# EasyEDA Pro project ProPrj_Y车Y形板_2025-09-30.epro, board PCB11
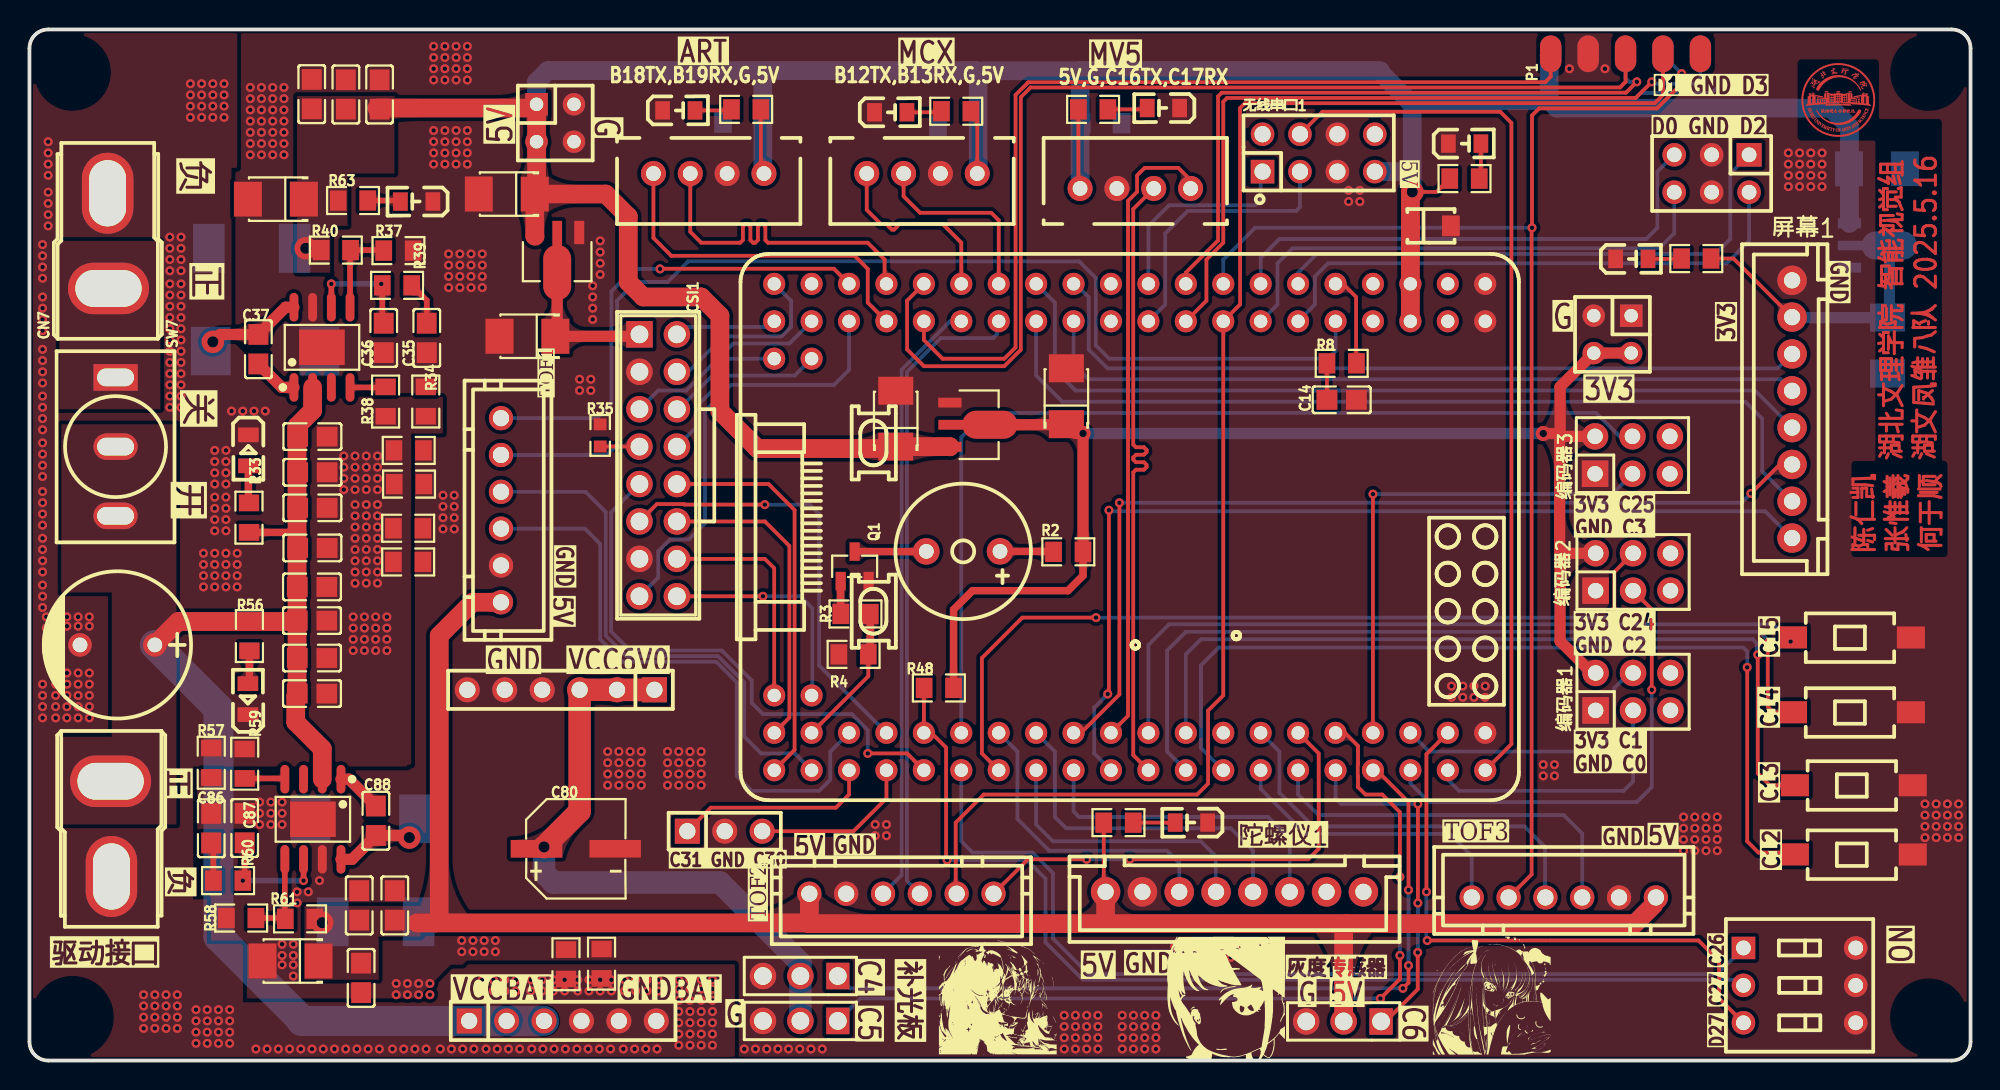
[diagram p6: board, top side]
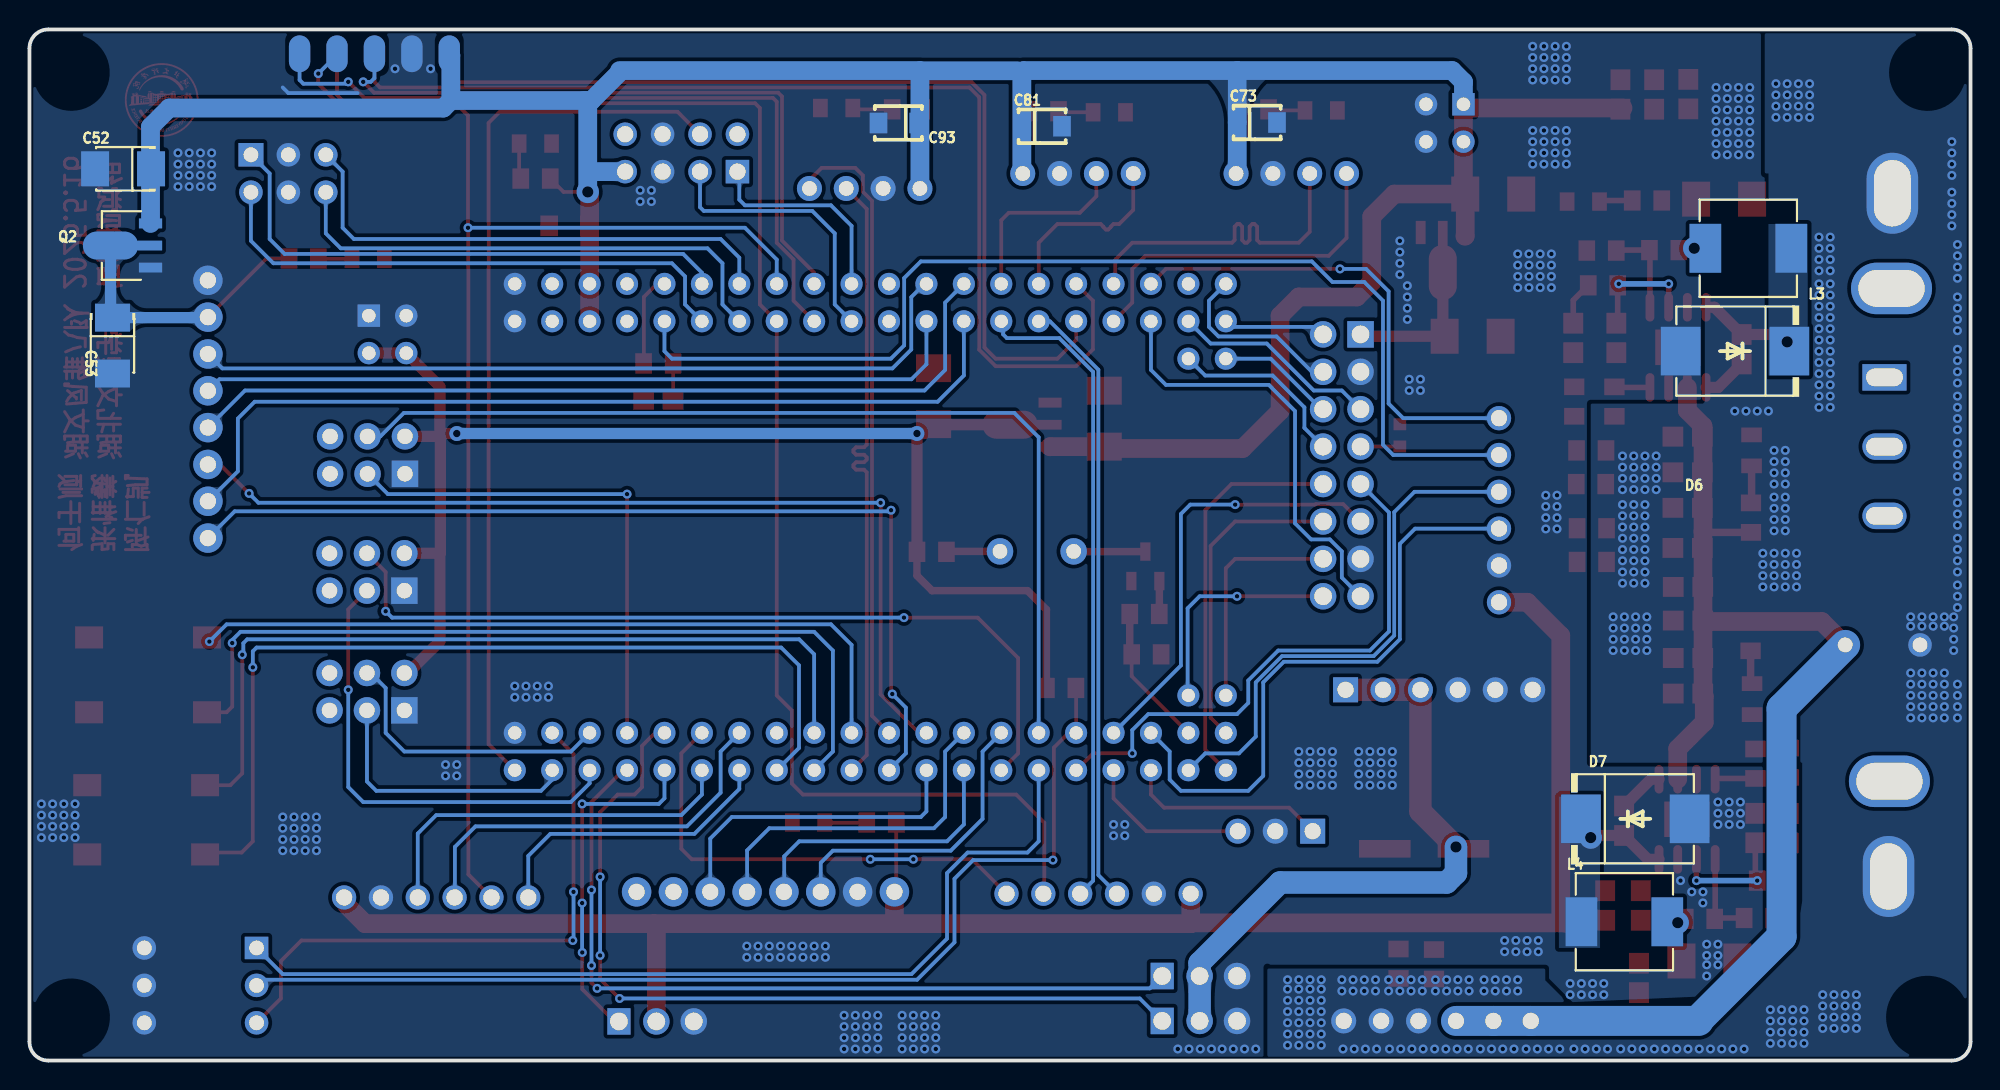
[diagram p7: board, bottom side, seen from below]

Outline 131.75 x 70 mm; copper layers: Top Layer, Bottom Layer. Coordinates in mm from the lower left corner of the outline.
Outline path: 0,68.73 0,1.27 arc(0.37,0.37) 1.27,0 130.48,0 arc(131.37,0.37) 131.75,1.27 131.75,68.73 arc(131.37,69.63) 130.48,70 1.27,70 arc(0.37,69.63) 0,68.73
Stack: Top Layer 0.035mm / Dielectric1 1.51mm FR4 er 4.5 / Bottom Layer 0.035mm

## Design rules (mm)
template: 自定义配置
spacing copperThickness1oz (default): track to track 0.102, other pairs 0.152 to 0.3
spacing copperThickness2oz: track to track 0.203, other pairs 0.152 to 0.3
track width copperThickness1oz (default): min 0.127, default 0.254, max 2.54
track width copperThickness2oz: min 0.203, default 0.254, max 2.54
differential pair differentialPair (default): width min 0.127, default 0.254, max 2.54; gap min 0.152, default 0.152
via viaSize (default): diameter min 0.5, default 0.61, max 10; hole min 0.3, default 0.305, max 6.3

## Placement (name value [footprint] x y rotation side)
BUZZER3  3kHz  [BUZ-TH_BD9.0-P5.00-D0.6-FD]  63.37 34.57 180 top
C1  TS-1101-C-W  [SW-SMD_L6.0-W3.3-LS8.0]  123.7 23.64 0 top
C12  TS-1101-C-W  [SW-SMD_L6.0-W3.3-LS8.0]  123.83 13.99 0 top
C13  TS-1101-C-W  [SW-SMD_L6.0-W3.3-LS8.0]  123.83 18.69 0 top
C14  10uF  [C0805]  89.06 44.86 180 top
C15  TS-1101-C-W  [SW-SMD_L6.0-W3.3-LS8.0]  123.7 28.72 0 top
C27  470uF  [CAP-TH_BD10.0-P5.00-D1.0-FD]  5.97 28.22 180 top
C31  4.7uF  [C0805]  19.2 34.8 180 top
C32  4.7uF  [C0805]  19.2 37.52 180 top
C33  4.7uF  [C0805]  19.2 39.94 180 top
C34  4.7uF  [C0805]  19.2 42.36 180 top
C35  620pF  [C0805]  26.97 49.06 90 top
C36  43pF  [C0805]  24.04 49.06 90 top
C37  1UF  [C0805]  15.54 48.29 90 top
C38  47uF  [CAP-SMD_L3.5-W2.8-R-RD]  16.73 58.48 0 top
C52  10uF  [CAP-SMD_L3.5-W2.8-R-RD]  125.39 60.54 180 bottom
C53  10uF  [CAP-SMD_L3.5-W2.8-R-RD]  126.11 48.54 90 bottom
C62  100nF  [C0805]  23.76 65.59 270 top
C63  100nF  [C0805]  21.48 65.59 270 top
C64  100nF  [C0805]  19.16 65.61 270 top
C65  10uF  [CAP-SMD_L3.5-W2.8-R-RD]  32.4 58.82 0 top
C66  10uF  [CAP-SMD_L3.5-W2.8-R-RD]  33.79 49.17 0 top
C67  10uF  [CAP-SMD_L3.5-W2.8-R-RD]  58.79 43.58 270 top
C68  10uF  [CAP-SMD_L3.5-W2.8-R-RD]  70.38 45.1 270 top
C70  22uF  [CAP-SMD_L3.2-W1.6]  95.12 56.67 0 top
C73  22uF  [CAP-SMD_L3.2-W1.6]  48.42 63.68 180 bottom
C80  220uF  [CAP-SMD_BD6.3-L6.6-W6.6-LS7.4-FD]  37.08 14.37 0 top
C81  22uF  [CAP-SMD_L3.2-W1.6]  63.01 63.43 180 bottom
C82  4.7uF  [C0805]  19.18 24.92 180 top
C83  4.7uF  [C0805]  19.18 27.33 180 top
C84  4.7uF  [C0805]  19.18 29.87 180 top
C85  4.7uF  [C0805]  19.18 32.15 180 top
C86  620pF  [C0805]  12.34 15.77 270 top
C87  43pF  [C0805]  14.61 15.78 270 top
C88  1UF  [C0805]  23.51 16.28 270 top
C89  47uF  [CAP-SMD_L3.5-W2.8-R-RD]  17.72 6.76 0 top
C90  100nF  [C0805]  22.38 10.53 270 top
C91  100nF  [C0805]  22.51 5.61 90 top
C92  100nF  [C0805]  24.79 10.53 270 top
C93  22uF  [CAP-SMD_L3.2-W1.6]  72.77 63.65 0 bottom
CN5  AM-1015B-M  [CONN-TH_AM-1015B-M]  5.53 15.73 270 top
CN7  AM-1015B-M  [CONN-TH_AM-1015B-M]  5.33 55.65 90 top
CSI1  2.54-2*8P针  [HDR-TH_16P-P2.54-V-M-R2-C8-S2.54]  42.67 40.41 270 top
D6  SS86  [SMC_L6.9-W5.9-LS7.9-RD]  15.99 48.17 0 bottom
D7  SS86  [SMC_L6.9-W5.9-LS7.9-RD]  22.75 16.41 180 bottom
H8  -  [HDR-TH_4P-P2.54-V-M-R2-C2-S2.54-1]  107.44 49.3 180 top
H9  -  [HDR-TH_4P-P2.54-V-M-R2-C2-S2.54-1]  35.69 63.65 270 top
H57  PZ254V-11-06P  [HDR-TH_6P-P2.54-V-M]  36.07 25.17 180 top
H60  77311-102-03LF  [HDR-TH_3P-P2.54-V-M-1]  52.32 5.74 180 top
H61  77311-102-03LF  [HDR-TH_3P-P2.54-V-M-1]  52.32 2.69 180 top
H62  -  [HDR-TH_6P-P2.54-V-F-R2-C3-S2.54]  114.17 60.22 180 top
H63  PZ254V-11-06P  [HDR-TH_6P-P2.54-V-M]  36.2 2.69 0 top
H68  77311-102-03LF  [HDR-TH_3P-P2.54-V-M-1]  89.2 2.66 180 top
H69  PZ254V-11-03P  [HDR-TH_3P-P2.54-V-M]  47.19 15.57 0 top
L3  15uH  [IND-SMD_L7.1-W6.6]  15.09 55.14 0 bottom
L4  15uH  [IND-SMD_L7.1-W6.6]  23.5 9.42 180 bottom
LED8  NCD0805R1  [LED0805-R-RD]  14.86 41.42 270 top
LED9  NCD0805R1  [LED0805-R-RD]  14.83 24.54 90 top
LED10  NCD0805R1  [LED0805-RD]  108.76 54.42 0 top
LED11  NCD0805R1  [LED0805-RD]  78.87 16.15 180 top
LED12  NCD0805R1  [LED0805-RD]  97.41 62.25 0 top
LED13  NCD0805R1  [LED0805-RD]  26.28 58.32 180 top
LED14  NCD0805R1  [LED0805-RD]  76.96 64.67 180 top
LED15  NCD0805R1  [LED0805-RD]  58.45 64.38 0 top
LED16  NCD0805R1  [LED0805-RD]  44.07 64.5 0 top
P1  -  [HDR2X5-OB]  108.33 68.35 90 top
Q1  S8050  [SOT-23-3_L2.9-W1.3-P1.90-LS2.4-BR]  56.01 33.55 270 top
Q2  AMS1117-3.3V  [SOT-89-3_L4.5-W2.5-P1.50-LS4.2-BR]  124.88 55.33 180 bottom
Q6  AMS1117-3.3V  [SOT-89-3_L4.5-W2.5-P1.50-LS4.2-BR]  35.82 54.86 90 top
Q7  AMS1117-3.3V  [SOT-89-3_L4.5-W2.5-P1.50-LS4.2-BR]  63.83 43.17 180 top
R2  10R  [R0805]  70.51 34.54 180 top
R3  4.7K  [R0805]  56.06 30.32 180 top
R4  10K  [R0805]  55.94 27.58 180 top
R8  10K  [R0805]  89.06 47.33 180 top
R33  1kΩ  [R0805]  14.9 36.86 270 top
R34  0Ω  [R0805]  26.9 44.74 90 top
R35  10kΩ  [R0603]  38.73 42.44 270 top
R37  10kΩ  [R0805]  25.04 54.99 180 top
R38  75kΩ  [R0805]  24.17 44.74 90 top
R39  18.7kΩ  [R0805]  24.95 52.63 180 top
R40  52.3kΩ  [R0805]  20.79 55.02 0 top
R48  4.7K  [R0805]  61.72 25.3 180 top
R50  0Ω  [R0805]  25.7 33.85 0 top
R51  0Ω  [R0805]  25.76 39.14 0 top
R52  0Ω  [R0805]  25.7 36.14 0 top
R53  0Ω  [R0805]  38.83 6.57 90 top
R54  0Ω  [R0805]  25.74 41.42 0 top
R55  0Ω  [R0805]  36.41 6.54 90 top
R56  1kΩ  [R0805]  14.93 28.82 90 top
R57  0Ω  [R0805]  12.34 20.22 270 top
R58  10kΩ  [R0805]  14.37 9.68 0 top
R59  75kΩ  [R0805]  14.61 20.15 270 top
R60  18.7kΩ  [R0805]  13.48 12.22 0 top
R61  52.3kΩ  [R0805]  18.37 9.62 180 top
R62  4.7K  [R0805]  97.4 59.88 180 top
R63  4.7K  [R0805]  21.96 58.39 180 top
R64  4.7K  [R0805]  72.19 64.58 180 top
R65  4.7K  [R0805]  62.9 64.45 0 top
R66  4.7K  [R0805]  73.91 16.15 180 top
R67  2.2K  [R0805]  113.13 54.45 0 top
R68  4.7K  [R0805]  48.64 64.58 0 top
SW6  KF1001-03P-R0-GL-DFT-01B  [SW-TH_6P-L9.9-W9.0-P2.54-LS7.6]  120.14 5.1 270 top
SW7  MT-0-103-A101-M200-RS+PJ  [SW-TH_MT-0-103-A101-M200-RS]  5.84 41.68 270 top
TOF1  WAFER-XH2.54-6PZZ  [CONN-TH_XH2.54-6P]  32 37.36 90 top
TOF2  WAFER-XH2.54-6PZZ  [CONN-TH_XH2.54-6P]  59.18 11.33 0 top
TOF3  WAFER-XH2.54-6PZZ  [CONN-TH_XH2.54-6P]  104.14 11.07 180 top
U1  TPS54540DDAR  [SOIC-8_L4.9-W3.9-P1.27-LS6.0-BL-EP]  19.85 48.42 0 top
U6  -  [AUFE_RT1064]  74.68 36.22 180 top
U27  TPS54540DDAR  [SOIC-8_L4.9-W3.9-P1.27-LS6.0-BL-EP]  19.24 16.38 180 top
U29  B4B-XH-A(LF)(SN)  [CONN-TH_B4B-XH-A-LF-SN]  60.58 60.22 180 top
U30  B4B-XH-A(LF)(SN)  [CONN-TH_B4B-XH-A-LF-SN]  75.06 59.2 0 top
U31  B4B-XH-A(LF)(SN)  [CONN-TH_B4B-XH-A-LF-SN]  46.1 60.22 180 top
屏幕1  WAFER-XH2.54-8PZZ  [CONN-TH_8P-P2.50-XH2.54-8P]  119.63 44.22 270 top
无线串口1  -  [HDR-TH_8P-P2.54-V-F-R2-C4-S2.54-1]  87.5 61.62 0 top
编码器1  67997-206HLF  [HDR-TH_6P-P2.54-V-M-R2-C3-S2.54-1]  108.84 25.04 0 top
编码器2  67997-206HLF  [HDR-TH_6P-P2.54-V-M-R2-C3-S2.54-1]  108.84 33.17 0 top
编码器3  67997-206HLF  [HDR-TH_6P-P2.54-V-M-R2-C3-S2.54-1]  108.8 41.11 0 top
陀螺仪1  WAFER-XH2.54-8PZZ  [CONN-TH_8P-P2.50-XH2.54-8P]  81.79 11.45 0 top

## Footprints (pads in the part's own frame, mm; a bottom-side part is the same pattern mirrored in y, then rotated)
AUFE_RT1064
  round 1.5 hole 0.9x0.9: 1(-24.13,-16.51) 2(-24.13,-13.97) 3(-21.59,-16.51) 4(-21.59,-13.97) 5(-19.05,-16.51) 6(-19.05,-13.97) 7(-16.51,-16.51) 8(-16.51,-13.97) 9(-13.97,-16.51) 10(-13.97,-13.97) 11(-11.43,-16.51) 12(-11.43,-13.97) 13(-8.89,-16.51) 14(-8.89,-13.97) 15(-6.35,-16.51) 16(-6.35,-13.97) 17(-3.81,-16.51) 18(-3.81,-13.97) 19(-1.27,-16.51) 20(-1.27,-13.97) 21(1.27,-16.51) 22(1.27,-13.97) 23(3.81,-16.51) 24(3.81,-13.97) 25(6.35,-16.51) 26(6.35,-13.97) 27(8.89,-16.51) 28(8.89,-13.97) 29(11.43,-16.51) 30(11.43,-13.97) 31(13.97,-16.51) 32(13.97,-13.97) 33(16.51,-16.51) 34(16.51,-13.97) 35(19.05,-16.51) 36(19.05,-13.97) 37(21.59,-16.51) 38(21.59,-13.97) 39(24.13,-16.51) 40(24.13,-13.97) 41(21.59,-11.43) 42(24.13,-11.43) 43(24.13,11.43) 44(21.59,11.43) 45(24.13,13.97) 46(24.13,16.51) 47(21.59,13.97) 48(21.59,16.51) 49(19.05,13.97) 50(19.05,16.51) 51(16.51,13.97) 52(16.51,16.51) 53(13.97,13.97) 54(13.97,16.51) 55(11.43,13.97) 56(11.43,16.51) 57(8.89,13.97) 58(8.89,16.51) 59(6.35,13.97) 60(6.35,16.51) 61(3.81,13.97) 62(3.81,16.51) 63(1.27,13.97) 64(1.27,16.51) 65(-1.27,13.97) 66(-1.27,16.51) 67(-3.81,13.97) 68(-3.81,16.51) 69(-6.35,13.97) 70(-6.35,16.51) 71(-8.89,13.97) 72(-8.89,16.51) 73(-11.43,13.97) 74(-11.43,16.51) 75(-13.97,13.97) 76(-13.97,16.51) 77(-16.51,13.97) 78(-16.51,16.51) 79(-19.05,13.97) 80(-19.05,16.51) 81(-21.59,13.97) 82(-21.59,16.51) 83(-24.13,13.97) 84(-24.13,16.51)
BUZ-TH_BD9.0-P5.00-D0.6-FD
  round 1.8 hole 1: 1(-2.5,0) 2(2.5,0)
C0805
  rect 1.41x1.35 smd: 1(-1,0) 2(1,0)
CAP-SMD_BD6.3-L6.6-W6.6-LS7.4-FD
  rect 3.5x1.2 smd: 1(-2.67,0) 2(2.67,0)
CAP-SMD_L3.2-W1.6
  rect 1.2x1.4 smd: 1(-1.35,0) 2(1.35,0)
CAP-SMD_L3.5-W2.8-R-RD
  rect 1.9x2.376 smd: 1(1.899,0) 2(-1.899,0)
CAP-TH_BD10.0-P5.00-D1.0-FD
  round 1.6 hole 1: 1(-2.54,0) 2(2.54,0)
CONN-TH_8P-P2.50-XH2.54-8P
  round 2 hole 1.1: 1(8.75,0) 2(6.25,0) 3(3.75,0) 4(1.25,0) 5(-1.25,0) 6(-3.75,0) 7(-6.25,0) 8(-8.75,0)
CONN-TH_AM-1015B-M
  oval 3.5x5.5 hole 2.5x4.5: 1(-3.231,-0.029)
  oval 5.5x3.5 hole 4.5x2.5: 2(3.231,0.029)
CONN-TH_B4B-XH-A-LF-SN
  round 1.7 hole 1: 1(3.75,0) 2(1.25,0) 3(-1.25,0) 4(-3.75,0)
CONN-TH_XH2.54-6P
  round 1.65 hole 1.1: 1(-6.25,0) 2(-3.75,0) 3(-1.25,0) 4(1.25,0) 5(3.75,0) 6(6.25,0)
HDR2X5-OB
  rrect 2.5x1.45 smd: 1(0,5.08) 3(0,2.54) 5(0,0) 7(0,-2.54) 9(0,-5.08)
  rrect 2.5x1.45 smd far side: 2(0,5.08) 4(0,2.54) 6(0,0) 8(0,-2.54) 10(0,-5.08)
HDR-TH_3P-P2.54-V-M
  rect 1.7x1.7 hole 1.1: 1(-2.54,0)
  round 1.7 hole 1.1: 2(0,0) 3(2.54,0)
HDR-TH_3P-P2.54-V-M-1
  rect 1.575x1.8 hole 1.2: 1(-2.54,0)
  round 1.8 hole 1.2: 2(0,0) 3(2.54,0)
HDR-TH_4P-P2.54-V-M-R2-C2-S2.54-1
  rect 1.524x1.524 hole 0.914: 1(-1.27,-1.27)
  round 1.524 hole 0.914: 2(-1.27,1.27) 3(1.27,-1.27) 4(1.27,1.27)
HDR-TH_6P-P2.54-V-F-R2-C3-S2.54
  rect 1.7x1.6 hole 1: 1(-2.54,-1.27)
  round 1.6 hole 1: 2(-2.54,1.27) 3(0,-1.27) 4(0,1.27) 5(2.54,-1.27) 6(2.54,1.27)
HDR-TH_6P-P2.54-V-M
  rect 1.7x1.7 hole 1.1: 1(-6.35,0)
  round 1.7 hole 1.1: 2(-3.81,0) 3(-1.27,0) 4(1.27,0) 5(3.81,0) 6(6.35,0)
HDR-TH_6P-P2.54-V-M-R2-C3-S2.54-1
  rect 1.8x1.8 hole 1.05: 1(-2.54,-1.27)
  round 1.8 hole 1.05: 2(-2.54,1.27) 3(0,-1.27) 4(0,1.27) 5(2.54,-1.27) 6(2.54,1.27)
HDR-TH_8P-P2.54-V-F-R2-C4-S2.54-1
  rect 1.6x1.6 hole 1.1: 1(-3.81,-1.27)
  round 1.6 hole 1.1: 2(-3.81,1.27) 3(-1.27,-1.27) 4(-1.27,1.27) 5(1.27,-1.27) 6(1.27,1.27) 7(3.81,-1.27) 8(3.81,1.27)
HDR-TH_16P-P2.54-V-M-R2-C8-S2.54
  rect 1.8x1.8 hole 1.2: 1(-8.89,-1.27)
  round 1.8 hole 1.2: 2(-8.89,1.27) 3(-6.35,-1.27) 4(-6.35,1.27) 5(-3.81,-1.27) 6(-3.81,1.27) 7(-1.27,-1.27) 8(-1.27,1.27) 9(1.27,-1.27) 10(1.27,1.27) 11(3.81,-1.27) 12(3.81,1.27) 13(6.35,-1.27) 14(6.35,1.27) 15(8.89,-1.27) 16(8.89,1.27)
IND-SMD_L7.1-W6.6
  rect 2.15x3.32 smd: 1(-2.913,0) 2(2.913,0)
LED0805-R-RD
  rect 1x1.399 smd: 1(1.05,0) 2(-1.05,0)
LED0805-RD
  rect 1x1.25 smd: 1(-1.1,0) 2(1.1,0)
R0603
  rect 0.806x0.864 smd: 1(-0.753,0) 2(0.753,0)
R0805
  rect 1.133x1.377 smd: 1(-1,0) 2(1,0)
SMC_L6.9-W5.9-LS7.9-RD
  rect 2.7x3.3 smd: 1(-3.687,0) 2(3.687,0)
SOIC-8_L4.9-W3.9-P1.27-LS6.0-BL-EP
  oval 0.602x1.941 smd: 1(-1.905,-2.72) 2(-0.635,-2.72) 3(0.635,-2.72) 4(1.905,-2.72) 5(1.905,2.72) 6(0.635,2.72) 7(-0.635,2.72) 8(-1.905,2.72)
  rect 3.098x2.41 smd: 9(0,0)
SOT-23-3_L2.9-W1.3-P1.90-LS2.4-BR
  rect 1.25x0.7 smd: 1(1,-0.95) 2(1,0.95) 3(-1,0)
SOT-89-3_L4.5-W2.5-P1.50-LS4.2-BR
  rect 1.575x0.672 smd: 1(1.356,-1.5) 3(1.356,1.5)
  custom 5.377x1.9 smd: 2(-1.356,0)
SW-SMD_L6.0-W3.3-LS8.0
  rect 1.9x1.5 smd: 1(-4,0) 2(4,0)
SW-TH_6P-L9.9-W9.0-P2.54-LS7.6
  rect 1.524x1.6 hole 1: 1(-2.54,-3.809)
  round 1.6 hole 1: 2(0,-3.81) 3(2.54,-3.81) 4(2.54,3.81) 5(0,3.81) 6(-2.54,3.81)
SW-TH_MT-0-103-A101-M200-RS
  rect 1.8x3 hole 1.2x2.5: 1(-4.7,0)
  oval 1.8x3 hole 1.2x2.5: 2(0,0) 3(4.7,0)

## Nets
3V3: C68.1 H8.2 H8.4 Q7.2 R2.1 R48.1 编码器1.2 编码器2.2 编码器3.2
3V31: C53.1 Q2.2 R67.2 屏幕1.7
GND: C1.2 C12.2 C13.2 C14.1 C15.2 C35.1 C36.1 C38.2 C52.2 C53.2 C62.1 C63.1 C64.1 C65.2 C66.2 C67.2 C68.2 C70.2 C73.2 C80.2 C81.2 C86.1 C87.1 C89.2 C90.1 C91.1 C92.1 C93.2 CSI1.3 CSI1.13 D6.2 D7.2 H8.1 H8.3 H9.2 H9.4 H57.4 H57.5 H57.6 H60.3 H61.3 H62.3 H62.4 H68.3 H69.2 LED10.1 LED11.1 LED12.1 LED13.1 LED14.1 LED15.1 LED16.1 P1.3 P1.4 Q1.2 Q2.1 Q6.1 Q7.1 R4.2 R34.2 R35.1 R37.1 R50.2 R51.2 R52.2 R53.2 R54.2 R55.2 R57.2 R58.1 SW6.4 SW6.5 SW6.6 TOF1.2 TOF2.2 TOF3.2 U1.7 U1.9 U6.1 U6.2 U6.83 U27.7 U27.9 U29.3 U30.3 U31.3 屏幕1.8 无线串口1.5 无线串口1.6 编码器1.1 编码器2.1 编码器3.1 陀螺仪1.7
GNDBAT: C27.2 C31.1 C32.1 C33.1 C34.1 C82.1 C83.1 C84.1 C85.1 CN5.2 CN7.2 H63.4 H63.5 H63.6 LED8.2 LED9.2 R34.1 R38.1 R50.1 R51.1 R52.1 R53.1 R54.1 R55.1 R57.1 R59.1
VCC5V: C38.1 C52.1 C62.2 C63.2 C64.2 C65.1 C67.1 C70.1 C73.1 C81.1 C93.1 H9.1 H9.3 L3.2 P1.2 Q2.3 Q6.3 Q7.3 R40.1 R62.2 R63.2 R64.2 R65.2 R68.2 U6.5 U6.6 U29.4 U30.4 U31.4 无线串口1.7
VCC5V0: C89.1 C90.2 C91.2 C92.2 H68.2 L4.2 R61.1 R66.2 TOF1.1 TOF2.1 TOF3.1 陀螺仪1.8
VCC6V0: C80.1 H57.1 H57.2 H57.3 H60.2 H61.2
VCCBAT: C27.1 C31.2 C32.2 C33.2 C34.2 C82.2 C83.2 C84.2 C85.2 CN5.1 H63.1 H63.2 H63.3 R33.2 R56.2 SW7.2 SW7.3 U1.2 U27.2
B0: U6.23 屏幕1.6
B1: U6.24 屏幕1.5
B2: U6.25 屏幕1.4
B3: U6.26 屏幕1.2
B9: TOF1.3 U6.49
B10: TOF1.4 U6.48
B11: R3.1 R4.1 U6.47
B12_TX: U6.29 U29.1
B13_RX: U6.27 U29.2
B14: TOF2.3 U6.30
B15: TOF2.4 U6.28
B16: P1.1 U6.32
B17: P1.5 U6.31
B18_TX: U6.34 U31.1
B19_RX: U6.33 U31.2
B20: CSI1.15 U6.36
B21: TOF1.6 U6.35
B22: CSI1.5 U6.38
B24: CSI1.2 U6.40
B25: CSI1.4 U6.39
B26: CSI1.6 U6.42
B27: CSI1.8 U6.41
B28: CSI1.10 U6.46
B29: CSI1.12 U6.45
B30: CSI1.14 U6.43
B31: CSI1.16 U6.44
C0: U6.82 编码器1.3
C1: U6.79 编码器1.4
C2: U6.80 编码器2.3
C3: U6.77 编码器3.3
C4: H60.1 U6.78
C5: H61.1 U6.75
C6: H68.1 U6.76
C7: TOF2.6 U6.73
C8: TOF3.3 U6.74
C9: TOF3.4 U6.71
C10: TOF3.6 U6.72
C12: C12.1 U6.70
C13: C13.1 U6.67
C14: C1.1 U6.68
C15: C15.1 U6.65
C16_TX: U6.66 U30.2
C17_RX: U6.63 U30.1
C18: U6.64 屏幕1.1
C19: U6.61 屏幕1.3
C20: U6.62 陀螺仪1.3
C21: U6.59 陀螺仪1.4
C22: U6.60 陀螺仪1.5
C23: U6.57 陀螺仪1.6
C24: U6.58 编码器2.4
C25: U6.55 编码器3.4
C26: SW6.1 U6.56
C27: R48.2 SW6.2 U6.53
C28: CSI1.9 U6.54
C29: CSI1.11 U6.51
C30: H69.3 U6.52
C31: H69.1 U6.50
CR: C14.2 R8.2
CSI-3V3: C66.1 CSI1.1 Q6.2
D0: H62.6 U6.14
D1: H62.5 U6.13
D2: H62.2 U6.12
D3: H62.1 U6.11
D4: TOF1.5 U6.10
D12: P1.8 TOF3.5 U6.15
D13: P1.7 TOF2.5 U6.16
D14: P1.6 U6.17
D15: P1.10 U6.18
D16: U6.19 无线串口1.1
D17: U6.20 无线串口1.3
D26: U6.84 无线串口1.4
D27: SW6.3 U6.81
$1N5765: Q1.1 R3.2
$1N5766: BUZZER3.2 Q1.3
$1N5940: BUZZER3.1 R2.2
$1N5970: CSI1.7 R35.2
$1N5984: R38.2 U1.4
$1N5985: C37.1 U1.1
$1N5986: C37.2 D6.1 L3.1 U1.8
$1N5987: C36.2 R39.2 U1.6
$1N5988: C35.2 R39.1
$1N5989: R37.2 R40.2 U1.5
$1N6012: R8.1 U6.9
$1N6034: LED8.1 R33.1
$1N6099: R59.2 U27.4
$1N6100: C88.1 U27.1
$1N6101: C88.2 D7.1 L4.1 U27.8
$1N6102: C87.2 R60.2 U27.6
$1N6103: C86.2 R60.1
$1N6104: R58.2 R61.2 U27.5
$1N6110: LED9.1 R56.1
$1N6112: LED12.2 R62.1
$1N6115: LED13.2 R63.1
$1N6120: LED14.2 R64.1
$1N6124: LED15.2 R65.1
$1N6125: LED11.2 R66.1
$1N6127: LED10.2 R67.1
$1N9649: LED16.2 R68.1
$1N16320: CN7.1 SW7.1

Pads without a net: P1 9; U1 3; U6 3 4 7 8 21 22 37 69; U27 3; 无线串口1 2 8; 编码器1 5 6; 编码器2 5 6; 编码器3 5 6; 陀螺仪1 1 2

## Via types
v1: diameter 0.61, hole 0.305, Top Layer to Bottom Layer, 671 vias
v2: diameter 1.524, hole 0.762, Top Layer to Bottom Layer, 6 vias
v3: diameter 1.016, hole 0.508, Top Layer to Bottom Layer, 2 vias

## Routing (per net, layer and track width the routed paths; a pad name or vN(x,y) marks a point on that pad's centre or on a via; arc(x,y) is an arc through that point)
3V3: length 94.7
  Top Layer w0.508: R2.1 71.51,32.92 70.48,31.9 64.01,31.9 62.72,30.61 R48.1
  Top Layer w0.762: 103.86,42.34 103.86,34.47 103.89,34.44 ; 103.86,42.34 103.63,42.57 v3(102.74,42.57) ; 103.86,42.34 103.86,42.38 103.89,42.38 ; 65.19,43.17 70.34,43.17 C68.1 71.01,42.57 v3(71.51,42.57) R2.1 ; 103.89,34.44 编码器2.2 ; 103.89,34.44 103.89,28.47 106.05,26.31 ; 103.89,42.38 103.89,45.75 106.17,48.03 108.71,48.03 ; 103.89,42.38 编码器3.2
  Bottom Layer w0.762: v3(71.51,42.57) 102.74,42.57 v3(102.74,42.57)
3V31: length 18.6
  Top Layer w0.254: R67.2 115.66,54.45 屏幕1.7
  Bottom Layer w0.762: 屏幕1.7 119.67,50.44 C53.1 126.24,50.56 Q2.2
GND: length 5.2
  Bottom Layer w0.254: 114.55,66.06 114.17,65.68 109.47,65.68
  vias: v1(14.99,66.06) v1(14.99,65.3) v1(14.99,64.54) v1(14.99,63.78) v1(14.99,63.02) v1(14.99,62.25) v1(14.99,61.49) v1(15.62,17.55) v1(15.62,16.79) v1(15.62,16.03) v1(15.75,66.06) v1(15.75,65.3) v1(15.75,64.54) v1(15.75,63.78) v1(15.75,63.02) v1(15.75,62.25) v1(15.75,61.49) v1(16.38,17.55) v1(16.38,16.79) v1(16.38,16.03) v1(16.51,66.06) v1(16.51,65.3) v1(16.51,64.54) v1(16.51,63.78) v1(16.51,63.02) v1(16.51,62.25) v1(16.51,61.49) v1(17.15,17.55) v1(17.15,16.79) v1(17.15,16.03) v1(17.15,7.9) v1(17.15,7.13) v1(17.15,6.5) v1(17.27,66.06) v1(17.27,65.3) v1(17.27,64.54) v1(17.27,63.78) v1(17.27,63.02) v1(17.27,62.25) v1(17.27,61.49) v1(17.91,7.9) v1(17.91,7.13) v1(17.91,6.5) v1(17.91,5.74) v1(18.16,11.45) v1(18.17,10.7) v1(18.92,11.45) v1(19.69,12.22) v1(24.89,5.23) v1(24.89,4.47) v1(25.65,5.23) v1(25.65,4.47) v1(26.42,5.23) v1(26.42,4.47) v1(27.18,5.23) v1(27.18,4.47) v1(27.43,68.86) v1(27.43,68.09) v1(27.43,67.33) v1(27.43,66.57) v1(27.43,63.14) v1(27.43,62.38) v1(27.43,61.62) v1(27.43,60.86) v1(28.07,38.38) v1(28.07,37.61) v1(28.07,36.85) v1(28.07,36.09) v1(28.19,68.86) v1(28.19,68.09) v1(28.19,67.33) v1(28.19,66.57) v1(28.19,63.14) v1(28.19,62.38) v1(28.19,61.62) v1(28.19,60.86) v1(28.45,54.76) v1(28.45,54) v1(28.45,53.24) v1(28.45,52.47) v1(28.83,38.38) v1(28.83,37.61) v1(28.83,36.85) v1(28.83,36.09) v1(28.96,68.86) v1(28.96,68.09) v1(28.96,67.33) v1(28.96,66.57) v1(28.96,63.14) v1(28.96,62.38) v1(28.96,61.62) v1(28.96,60.86) v1(29.21,54.76) v1(29.21,54) v1(29.21,53.24) v1(29.21,52.47) v1(29.34,8.15) v1(29.34,7.39) v1(29.72,68.86) v1(29.72,68.09) v1(29.72,67.33) v1(29.72,66.57) v1(29.72,63.14) v1(29.72,62.38) v1(29.72,61.62) v1(29.72,60.86) v1(29.97,54.76) v1(29.97,54) v1(29.97,53.24) v1(29.97,52.47) v1(30.1,8.15) v1(30.1,7.39) v1(30.73,54.76) v1(30.73,54) v1(30.73,53.24) v1(30.73,52.47) v1(30.86,8.15) v1(30.86,7.39) v1(31.62,8.15) v1(31.62,7.39) v1(37.34,46.25) v1(37.34,45.49) v1(38.1,46.25) v1(38.1,45.49) v1(38.23,52.6) v1(38.23,51.84) v1(38.23,51.08) v1(38.23,50.31) v1(38.73,55.65) v1(38.73,54.89) v1(38.73,54.12) v1(38.73,53.36) v1(39.24,20.98) v1(39.24,20.22) v1(39.24,19.45) v1(39.24,18.69) v1(40.01,20.98) v1(40.01,20.22) v1(40.01,19.45) v1(40.01,18.69) v1(40.77,20.98) v1(40.77,20.22) v1(40.77,19.45) v1(40.77,18.69) v1(41.53,20.98) v1(41.53,20.22) v1(41.53,19.45) v1(41.53,18.69) v1(43.31,20.98) v1(43.31,20.22) v1(43.31,19.45) v1(43.31,18.69) v1(44.07,20.98) v1(44.07,20.22) v1(44.07,19.45) v1(44.07,18.69) v1(44.83,20.98) v1(44.83,20.22) v1(44.83,19.45) v1(44.83,18.69) v1(45.59,20.98) v1(45.59,20.22) v1(45.59,19.45) v1(45.59,18.69) v1(48.51,0.78) v1(49.28,0.78) v1(50.04,0.78) v1(50.8,0.78) v1(51.52,0.78) v1(52.28,0.78) v1(53.04,0.78) v1(53.8,0.78) v1(57.4,16.03) v1(57.4,15.26) v1(58.17,16.03) v1(58.17,15.26) v1(70.23,3.07) v1(70.23,2.31) v1(70.23,1.55) v1(70.23,0.78) v1(70.99,3.07) v1(70.99,2.31) v1(70.99,1.55) v1(70.99,0.78) v1(71.76,3.07) v1(71.76,2.31) v1(71.76,1.55) v1(71.76,0.78) v1(72.52,3.07) v1(72.52,2.31) v1(72.52,1.55) v1(72.52,0.78) v1(74.17,3.07) v1(74.17,2.31) v1(74.17,1.55) v1(74.17,0.78) v1(74.93,3.07) v1(74.93,2.31) v1(74.93,1.55) v1(74.93,0.78) v1(75.69,3.07) v1(75.69,2.31) v1(75.69,1.55) v1(75.69,0.78) v1(76.45,3.07) v1(76.45,2.31) v1(76.45,1.55) v1(76.45,0.78) v1(77.72,7.77) v1(77.72,7.01) v1(78.49,7.77) v1(78.49,7.01) v1(79.25,7.77) v1(79.25,7.01) v1(80.01,7.77) v1(80.01,7.01) v1(80.77,7.77) v1(80.77,7.01) v1(81.53,7.77) v1(81.53,7.01) v1(82.3,7.77) v1(82.3,7.01) v1(83.06,7.77) v1(83.06,7.01) v1(89.54,59.08) v1(89.54,58.32) v1(90.3,59.08) v1(90.3,58.32) v1(96.52,25.42) v1(96.52,24.66) v1(97.28,25.42) v1(97.28,24.66) v1(98.04,25.42) v1(98.04,24.66) v1(98.81,25.42) v1(98.81,24.66) v1(102.74,20.09) v1(102.74,19.33) v1(103.51,20.09) v1(103.51,19.33) v1(104.52,67.33) v1(106.93,67.33) v1(112.27,16.53) v1(112.27,15.77) v1(112.27,15.01) v1(112.27,14.25) v1(113.03,16.53) v1(113.03,15.77) v1(113.03,15.01) v1(113.03,14.25) v1(113.79,16.53) v1(113.79,15.77) v1(113.79,15.01) v1(113.79,14.25) v1(114.55,16.53) v1(114.55,15.77) v1(114.55,15.01) v1(114.55,14.25) v1(119.38,61.62) v1(119.38,60.86) v1(119.38,60.09) v1(119.38,59.33) v1(120.14,61.62) v1(120.14,60.86) v1(120.14,60.09) v1(120.14,59.33) v1(120.9,61.62) v1(120.9,60.86) v1(120.9,60.09) v1(120.9,59.33) v1(121.67,61.62) v1(121.67,60.86) v1(121.67,60.09) v1(121.67,59.33) v1(128.65,17.42) v1(128.65,16.66) v1(128.65,15.9) v1(128.65,15.14) v1(129.41,17.42) v1(129.41,16.66) v1(129.41,15.9) v1(129.41,15.14) v1(130.18,17.42) v1(130.18,16.66) v1(130.18,15.9) v1(130.18,15.14) v1(130.94,17.42) v1(130.94,16.66) v1(130.94,15.9) v1(130.94,15.14)
GNDBAT:
  vias: v1(0.89,55.39) v1(0.89,54.63) v1(0.89,53.87) v1(0.89,53.11) v1(0.89,51.84) v1(0.89,51.08) v1(0.89,50.31) v1(0.89,49.55) v1(0.89,48.28) v1(0.89,47.52) v1(0.89,46.76) v1(0.89,46) v1(0.89,45.11) v1(0.89,44.35) v1(0.89,43.58) v1(0.89,42.82) v1(0.89,41.93) v1(0.89,41.17) v1(0.89,40.41) v1(0.89,39.65) v1(0.89,38.63) v1(0.89,37.87) v1(0.89,37.11) v1(0.89,36.34) v1(0.89,35.46) v1(0.89,34.69) v1(0.89,33.93) v1(0.89,33.17) v1(0.89,32.28) v1(0.89,31.52) v1(0.89,30.76) v1(0.89,25.55) v1(0.89,24.79) v1(0.89,24.03) v1(0.89,23.26) v1(1.14,30.12) v1(1.14,29.36) v1(1.14,28.6) v1(1.14,27.84) v1(1.27,62.38) v1(1.27,61.62) v1(1.27,60.86) v1(1.27,60.09) v1(1.27,58.95) v1(1.27,58.19) v1(1.27,57.43) v1(1.27,56.67) v1(1.78,30.12) v1(1.78,29.49) v1(1.78,26.31) v1(1.78,25.55) v1(1.78,24.79) v1(1.78,24.03) v1(1.78,23.26) v1(2.54,30.12) v1(2.54,29.49) v1(2.54,26.31) v1(2.54,25.55) v1(2.54,24.79) v1(2.54,24.03) v1(2.54,23.26) v1(3.3,30.12) v1(3.3,29.49) v1(3.3,26.31) v1(3.3,25.55) v1(3.3,24.79) v1(3.3,24.03) v1(3.3,23.26) v1(4.06,30.12) v1(4.06,29.49) v1(4.06,26.31) v1(4.06,25.55) v1(4.06,24.79) v1(4.06,24.03) v1(4.06,23.26) v1(7.75,4.47) v1(7.75,3.71) v1(7.75,2.94) v1(7.75,2.18) v1(8.51,4.47) v1(8.51,3.71) v1(8.51,2.94) v1(8.51,2.18) v1(9.27,4.47) v1(9.27,3.71) v1(9.27,2.94) v1(9.27,2.18) v1(9.53,55.9) v1(9.53,55.14) v1(9.53,54.38) v1(9.53,53.62) v1(9.53,52.73) v1(9.53,51.97) v1(9.53,51.2) v1(9.53,50.44) v1(9.53,49.68) v1(9.53,48.92) v1(9.53,48.16) v1(9.53,47.39) v1(9.53,46.63) v1(9.53,45.87) v1(9.53,45.11) v1(9.53,44.35) v1(10.03,4.47) v1(10.03,3.71) v1(10.03,2.94) v1(10.03,2.18) v1(10.29,55.9) v1(10.29,55.14) v1(10.29,54.38) v1(10.29,53.62) v1(10.29,52.73) v1(10.29,51.97) v1(10.29,51.2) v1(10.29,50.44) v1(10.29,49.68) v1(10.29,48.92) v1(10.29,48.16) v1(10.29,47.39) v1(10.29,46.63) v1(10.29,45.87) v1(10.29,45.11) v1(10.29,44.35) v1(10.92,66.32) v1(10.92,65.56) v1(10.92,64.79) v1(10.92,64.03) v1(11.3,3.45) v1(11.3,2.69) v1(11.3,1.93) v1(11.3,1.17) v1(11.68,66.32) v1(11.68,65.56) v1(11.68,64.79) v1(11.68,64.03) v1(11.81,34.44) v1(11.81,33.68) v1(11.81,32.92) v1(11.81,32.15) v1(12.06,3.45) v1(12.06,2.69) v1(12.06,1.93) v1(12.06,1.17) v1(12.45,66.32) v1(12.45,65.56) v1(12.45,64.79) v1(12.45,64.03) v1(12.57,41.42) v1(12.57,40.66) v1(12.57,39.9) v1(12.57,39.14) v1(12.57,38.25) v1(12.57,37.49) v1(12.57,36.73) v1(12.57,35.96) v1(12.57,34.44) v1(12.57,33.68) v1(12.57,32.92) v1(12.57,32.15) v1(12.83,3.45) v1(12.83,2.69) v1(12.83,1.93) v1(12.83,1.17) v1(13.21,66.32) v1(13.21,65.56) v1(13.21,64.79) v1(13.21,64.03) v1(13.34,41.42) v1(13.34,40.66) v1(13.34,39.9) v1(13.34,39.14) v1(13.34,38.25) v1(13.34,37.49) v1(13.34,36.73) v1(13.34,35.96) v1(13.34,34.44) v1(13.34,33.68) v1(13.34,32.92) v1(13.34,32.15) v1(13.59,3.45) v1(13.59,2.69) v1(13.59,1.93) v1(13.59,1.17) v1(13.72,44.09) v1(14.1,34.44) v1(14.1,33.68) v1(14.1,32.92) v1(14.1,32.15) v1(14.48,44.09) v1(15.24,44.09) v1(15.37,0.78) v1(16,44.09) v1(16.13,0.78) v1(16.89,0.78) v1(17.65,0.78) v1(18.42,0.78) v1(19.18,0.78) v1(19.94,0.78) v1(20.7,0.78) v1(21.34,41.04) v1(21.34,40.28) v1(21.34,39.52) v1(21.34,38.76) v1(21.46,0.78) v1(21.97,30.12) v1(21.97,29.36) v1(21.97,28.6) v1(21.97,27.84) v1(22.1,41.04) v1(22.1,40.28) v1(22.1,39.52) v1(22.1,38.76) v1(22.1,37.74) v1(22.1,36.98) v1(22.1,36.22) v1(22.1,35.46) v1(22.1,34.69) v1(22.1,33.93) v1(22.1,33.17) v1(22.1,32.4) v1(22.23,0.78) v1(22.73,30.12) v1(22.73,29.36) v1(22.73,28.6) v1(22.73,27.84) v1(22.86,41.04) v1(22.86,40.28) v1(22.86,39.52) v1(22.86,38.76) v1(22.86,37.74) v1(22.86,36.98) v1(22.86,36.22) v1(22.86,35.46) v1(22.86,34.69) v1(22.86,33.93) v1(22.86,33.17) v1(22.86,32.41) v1(22.99,0.78) v1(23.5,30.12) v1(23.5,29.36) v1(23.5,28.6) v1(23.5,27.84) v1(23.62,41.04) v1(23.62,40.28) v1(23.62,39.52) v1(23.62,38.76) v1(23.62,37.74) v1(23.62,36.98) v1(23.62,36.22) v1(23.62,35.46) v1(23.62,34.69) v1(23.62,33.93) v1(23.62,33.17) v1(23.62,32.41) v1(23.75,0.78) v1(24.26,30.12) v1(24.26,29.36) v1(24.26,28.6) v1(24.26,27.84) v1(24.64,0.78) v1(25.4,0.78) v1(26.16,0.78) v1(26.92,0.78) v1(27.88,0.78) v1(28.64,0.78) v1(29.4,0.78) v1(30.17,0.78) v1(30.73,5.48) v1(30.73,4.72) v1(30.99,0.78) v1(31.5,5.48) v1(31.5,4.72) v1(31.75,0.78) v1(32.26,5.48) v1(32.26,4.72) v1(32.51,0.78) v1(33.02,5.48) v1(33.02,4.72) v1(33.27,0.78) v1(34.04,5.48) v1(34.04,4.72) v1(34.09,0.78) v1(34.8,5.48) v1(34.8,4.72) v1(34.85,0.78) v1(35.56,5.48) v1(35.56,4.72) v1(35.61,0.78) v1(36.32,5.48) v1(36.32,4.72) v1(36.37,0.78) v1(37.21,5.48) v1(37.21,4.72) v1(37.15,0.78) v1(37.92,0.78) v1(37.97,5.48) v1(37.97,4.72) v1(38.68,0.78) v1(38.73,5.48) v1(38.73,4.72) v1(39.5,5.48) v1(39.5,4.72) v1(39.44,0.78) v1(40.31,0.78) v1(40.39,5.48) v1(40.39,4.72) v1(41.07,0.78) v1(41.15,5.48) v1(41.15,4.72) v1(41.91,5.48) v1(41.91,4.72) v1(41.83,0.78) v1(42.59,0.78) v1(42.67,5.48) v1(42.67,4.72) v1(44.07,5.48) v1(44.07,4.85) v1(44.07,4.09) v1(44.07,3.32) v1(44.07,2.56) v1(44.07,1.8) v1(44.07,1.04) v1(44.83,5.48) v1(44.83,4.85) v1(44.83,4.09) v1(44.83,3.32) v1(44.83,2.56) v1(44.83,1.8) v1(44.83,1.04) v1(45.59,5.48) v1(45.59,4.85) v1(45.59,4.09) v1(45.59,3.32) v1(45.59,2.56) v1(45.59,1.8) v1(45.59,1.04) v1(46.36,5.48) v1(46.36,4.85) v1(46.36,4.09) v1(46.36,3.32) v1(46.36,2.56) v1(46.36,1.8) v1(46.36,1.04)
VCC5V: length 219.4
  Top Layer w0.254: U29.4 64.33,64.02 R65.2 ; R62.2 95.49,58.97 v2(93.85,58.97) ; R64.2 71.19,59.32 U30.4 ; R68.2 49.64,60.43 U31.4
  Top Layer w1.27: C65.1 34.3,55.98 34.32,55.96 ; C65.1 39.12,58.82 40.64,57.3 40.64,52.86 41.66,51.84 45.59,51.84 46.86,50.57 46.86,44.09 49.4,41.55 58.67,41.55 C67.1 62.46,41.68 Q7.3 ; C65.1 34.42,58.94 34.42,64.67 23.59,64.67 ; v2(93.85,58.97) 93.73,58.84 U6.5 U6.6
  Bottom Layer w1.27: 103.14,65.17 94.08,65.17 93.85,64.94 v2(93.85,58.97) ; 103.14,65.17 103.65,64.67 122.26,64.67 123.53,63.4 Q2.3 ; 103.14,65.17 103.14,68.24 P1.2 ; U31.4 49.77,60.3 C73.1 49.77,67.21 ; 91.69,67.21 71.31,67.21 U30.4 ; 71.3,67.19 64.69,67.19 ; 49.77,67.21 64.26,67.21 64.39,67.08 64.39,60.28 U29.4 ; 49.77,67.21 35.18,67.21 34.42,66.44 34.42,65.3 ; 无线串口1.7 93.6,60.35 ; 93.98,65.17 93.6,65.17 91.69,67.08
  vias: v2(18.75,55.14)
VCC5V0: length 124.3
  Top Layer w0.254: 72.91,15.77 72.91,11.58 陀螺仪1.8
  Top Layer w1.27: 89.37,9.29 89.2,9.12 H68.2 ; 89.37,9.29 108.97,9.29 110.24,10.56 ; 89.37,9.29 52.93,9.29 ; 52.93,9.29 52.93,9.3 TOF2.1 ; 52.93,9.29 52.88,9.34 27.56,9.34 ; TOF1.1 30.07,31.11 27.81,28.85 27.81,9.6 27.56,9.34 ; 27.56,9.34 26.29,9.34 ; 73.02,9.55 73.04,9.56 陀螺仪1.8
  vias: v2(19.87,9.36)
VCC6V0: length 42.4
  Top Layer w1.524: v2(34.93,14.5) 37.34,16.91 H57.3 H57.2 H57.1
  Bottom Layer w1.524: H61.2 52.32,6.63 46.86,12.09 35.56,12.09 34.93,12.72 v2(34.93,14.5)
VCCBAT: length 87.4
  Top Layer w0.508: R33.2 18.11,35.86 18.16,35.91
  Top Layer w1.27: C27.1 10.1,29.81 18.07,29.81 ; U1.2 19.22,44.13 18.16,43.08 18.16,24.81 18.07,24.73 18.07,22.97 19.87,21.17 19.87,19.1
  Bottom Layer w2.032: 18.45,2.78 12.83,8.41 12.83,23.9 C27.1 ; H63.3 H63.2 H63.1 18.45,2.69
B0: length 53.6
  Bottom Layer w0.254: 屏幕1.6 118.65,46.99 73.18,46.99 71.89,48.27 71.89,51.83 70.99,52.73 U6.23
B1: length 52.4
  Bottom Layer w0.254: 屏幕1.5 118.85,46.25 71.88,46.25 70.87,47.27 U6.24
B2: length 58
  Bottom Layer w0.254: 屏幕1.4 117.11,45.49 70.99,45.49 69.6,46.89 69.6,51.46 U6.25
B3: length 60.6
  Bottom Layer w0.254: U6.26 68.33,46.5 70.1,44.73 116.46,44.73 117.6,43.58 117.6,40 屏幕1.2
B9: length 41.3
  Bottom Layer w0.254: TOF1.3 37.7,36.11 38.73,35.08 38.73,28.6 40.26,27.07 46.61,27.07 48.01,25.68 48.01,19.33 49.02,18.31 53.59,18.31 54.36,19.07 54.36,20.98 U6.49
B10: length 36
  Bottom Layer w0.254: TOF1.4 37.74,38.61 39.12,37.23 39.12,28.85 40.51,27.45 46.73,27.45 48.51,25.67 48.51,21.99 49.66,20.85 51.94,20.85 U6.48
B11: length 9.7
  Top Layer w0.254: U6.47 56.94,26.1 R4.1
  Top Layer w0.508: R3.1 57.06,27.7 R4.1
B12_TX: length 12.9
  Top Layer w0.254: U29.1 56.83,57.75 57.79,56.79 58.17,56.79 58.35,56.61 58.35,56.59 58.53,56.41 58.68,56.41 58.86,56.59 58.86,56.61 59.04,56.79 61.98,56.79 63.25,55.52 U6.29
B13_RX: length 13
  Top Layer w0.254: U29.2 59.33,58.68 60.45,57.55 65.28,57.55 65.79,57.05 U6.27
B14: length 41.5
  Bottom Layer w0.254: U6.30 62.48,50.19 59.2,46.9 59.2,12.59 TOF2.3
B15: length 43.9
  Bottom Layer w0.254: TOF2.4 59.55,12.21 59.55,46.75 61.84,49.05 65.41,49.05 65.66,49.3 65.66,50.06 U6.28
B16: length 63.9
  Top Layer w0.254: U6.32 60.71,48.92 61.98,47.65 66.17,47.65 66.93,48.41 66.93,65.55 67.8,66.42 102.87,66.42 103.25,66.8 P1.1
B17: length 74.1
  Top Layer w0.254: P1.5 108.33,66.44 107.95,66.06 67.95,66.06 67.29,65.4 67.29,48.26 66.17,47.14 60.71,47.14 59.56,48.28 59.56,51.58 U6.31
B18_TX: length 23.9
  Top Layer w0.254: U6.34 56.9,51.46 56.9,53.74 56.01,54.63 43.56,54.63 42.35,55.84 U31.1
B19_RX: length 23.9
  Top Layer w0.254: U31.2 44.85,56.26 45.59,55.52 48.24,55.52 48.42,55.7 48.42,56.61 48.6,56.79 48.75,56.79 48.93,56.61 48.93,55.7 49.11,55.52 49.26,55.52 49.44,55.7 49.44,56.61 49.62,56.79 49.77,56.79 49.95,56.61 49.95,55.7 50.13,55.52 56.9,55.52 58.04,54.38 58.04,52.86 U6.33
B20: length 29.4
  Bottom Layer w0.254: U6.36 55.63,46.89 54.61,45.87 47.62,45.87 45.85,44.09 45.85,36.47 44.76,35.38 43.49,35.38 42.67,34.57 42.67,32.79 41.4,31.52
B21: length 32.7
  Top Layer w0.254: v1(42.8,53.74) 42.81,53.76 54.6,53.76 U6.35
  Bottom Layer w0.254: v1(42.8,53.74) 41.02,53.74 39.5,52.22 39.5,44.6 38.51,43.61 TOF1.6
B22: length 14.2
  Bottom Layer w0.254: 41.4,44.22 42.67,45.49 44.58,45.49 47.77,48.68 51.58,48.68 U6.38
B24: length 7
  Bottom Layer w0.254: CSI1.2 44.45,49.81 50.17,49.81 U6.40
B25: length 12.4
  Bottom Layer w0.254: CSI1.4 44.7,46.76 47.1,49.16 51.04,49.16 51.69,49.81 51.69,51.58 U6.39
B26: length 8
  Bottom Layer w0.254: CSI1.6 44.07,44.22 47.5,47.65 U6.42
B27: length 12.4
  Bottom Layer w0.254: U6.41 51.94,46.5 47.37,46.5 45.21,44.35 45.21,42.95 CSI1.8
B28: length 27
  Top Layer w0.254: U6.46 51.93,21.09 51.93,37.37 50.17,39.14 CSI1.10
B29: length 21.4
  Top Layer w0.254: U6.45 51.58,23.28 51.58,34.94 49.91,36.6 CSI1.12
B30: length 15.5
  Top Layer w0.254: U6.43 50.55,33.42 49.91,34.06 CSI1.14
B31: length 15.5
  Top Layer w0.254: CSI1.16 v1(49.78,31.52)
  Bottom Layer w0.254: U6.44 53.14,24.84 53.14,30.7 52.32,31.52 v1(49.78,31.52)
C0: length 18.7
  Bottom Layer w0.254: 108.58,23.77 108.84,23.52 108.84,18.95 108.2,18.31 97.03,18.31 96.27,19.07 U6.82
C1: length 19.4
  Bottom Layer w0.254: U6.79 95,20.98 106.3,20.98 107.57,22.25 107.57,25.3 108.58,26.31
C2: length 32.1
  Top Layer w0.254: 编码器2.3 110.11,30.63 v1(110.11,25.17)
  Bottom Layer w0.254: U6.80 93.73,18.82 95,17.55 109.09,17.55 110.11,18.56 v1(110.11,25.17)
C3: length 34.4
  Top Layer w0.254: U6.77 v1(91.19,38.45)
  Bottom Layer w0.254: v1(91.19,38.45) 107.42,38.45 编码器3.3
C4: length 54.8
  Top Layer w0.254: v1(93.6,6.45) 93.6,5.28 v1(93.22,4.9) ; U6.78 91.44,19.71 93.6,17.55 v1(93.6,11.58)
  Bottom Layer w0.254: v1(93.6,11.58) v1(93.6,6.45) ; H60.1 55.7,4.9 v1(93.22,4.9)
C5: length 58.9
  Top Layer w0.254: v1(93.02,7.13) 93.02,5.53 v1(91.69,4.21) ; U6.75 89.28,22.25 90.17,21.36 90.17,20.15 90.16,20.13 90.16,19.28 90.17,19.27 90.17,18.56 90.68,18.06 91.82,18.06 93.02,16.86 v1(93.02,12.47)
  Bottom Layer w0.254: H61.1 56.39,4.21 v1(91.69,4.21) ; v1(93.02,12.47) v1(93.02,7.13)
C6: length 23.6
  Top Layer w0.254: v1(94.22,7.34) 94.22,4.84 91.86,2.48 ; v1(94.23,17.42) v1(94.23,10.69)
  Bottom Layer w0.254: v1(94.23,10.69) 94.23,7.35 v1(94.22,7.34) ; v1(94.23,17.42) 89.03,17.42 88.65,17.8 U6.76
C7: length 31.8
  Top Layer w0.254: v1(74.68,13.66) 86.79,13.66 87.5,14.37 87.5,20.85 U6.73 ; v1(71.76,13.66) 67.77,13.66 TOF2.6
  Bottom Layer w0.254: v1(71.76,13.66) v1(74.68,13.66)
C8: length 26.4
  Bottom Layer w0.254: U6.74 86.11,18.06 87.5,16.66 104.14,16.66 105.39,15.41 TOF3.3
C9: length 27.6
  Bottom Layer w0.254: U6.71 84.84,20.98 84.84,18.18 87.12,15.9 101.47,15.9 102.87,14.5 102.87,11.09 TOF3.4
C10: length 20.3
  Bottom Layer w0.254: U6.72 83.57,18.44 86.61,15.39 96.39,15.39 97.89,13.89 TOF3.6
C12: length 62.1
  Top Layer w0.254: v1(116.59,26.69) 116.59,14.88 117.35,14.12 119.83,14.12 119.95,13.99
  Bottom Layer w0.254: v1(116.59,26.69) 116.59,27.78 116.33,28.04 80.72,28.04 79.52,26.83 79.52,21.22 U6.70
C13: length 56.5
  Top Layer w0.254: 119.95,18.69 118.11,18.69 117.3,19.5 v1(117.3,27.55)
  Bottom Layer w0.254: v1(117.3,27.55) 117.23,27.62 117.23,28.34 116.97,28.6 79.5,28.6 78.49,27.58 U6.67
C14: length 56.6
  Top Layer w0.254: C1.1 118.36,23.64 117.98,24.03 v1(117.98,28.34)
  Bottom Layer w0.254: U6.68 77.22,20.98 77.22,27.84 78.49,29.11 117.43,29.11 117.98,28.55 v1(117.98,28.34)
C15: length 50.6
  Bottom Layer w0.254: U6.65 75.95,28.22 77.34,29.61 118.36,29.61 v1(119.53,28.44)
C16_TX: length 43.3
  Top Layer w0.254: U30.2 74.92,57.81 74.92,41.82 75.1,41.64 75.64,41.64 75.82,41.46 75.82,41.31 75.64,41.13 75.1,41.13 74.92,40.95 74.92,40.8 75.1,40.62 75.64,40.62 75.82,40.44 75.82,40.29 75.64,40.11 75.1,40.11 74.92,39.93 74.92,20.74 U6.66
C17_RX: length 43.3
  Top Layer w0.254: U6.63 74.56,23.4 74.56,58.36 75.18,58.98 75.18,60.09 75.69,60.6 77.98,60.6 78.81,59.77 U30.1
C18: length 65.7
  Top Layer w0.254: v1(73.18,24.88) 73.27,24.97 v1(73.27,37.36)
  Bottom Layer w0.254: 屏幕1.1 117.82,37.28 73.34,37.28 v1(73.27,37.36) ; U6.64 72.26,20.85 72.26,23.96 v1(73.18,24.88)
C19: length 63.9
  Top Layer w0.254: v1(73.98,37.87) 73.98,24.85 71.37,22.25 U6.61 ; v1(116.84,38.5) 118.8,40.47 屏幕1.3
  Bottom Layer w0.254: v1(116.84,38.5) 116.2,37.87 v1(73.98,37.87)
C20: length 21.8
  Bottom Layer w0.254: 陀螺仪1.3 85.54,15.07 84.07,16.53 71.25,16.53 70.87,16.91 U6.62
C21: length 23.4
  Bottom Layer w0.254: 陀螺仪1.4 83.04,14.27 81.53,15.77 70.36,15.77 69.6,16.53 69.6,20.98 U6.59
C22: length 19.2
  Bottom Layer w0.254: 陀螺仪1.5 80.52,11.47 80.52,13.87 79.5,14.88 69.47,14.88 68.33,16.03 U6.60
C23: length 20.6
  Bottom Layer w0.254: U6.57 67.06,20.98 67.06,16.41 69.22,14.25 77.22,14.25 78.04,13.42 陀螺仪1.6
C24: length 56.8
  Top Layer w0.254: U6.58 64.64,20.85 64.64,27.33 67.38,30.07 v1(72.39,30.07) ; 编码器2.4 107.57,33.17 v1(107.57,30.5)
  Bottom Layer w0.254: v1(107.57,30.5) 107.14,30.07 v1(72.39,30.07)
C25: length 67
  Bottom Layer w0.254: U6.55 63.25,42.31 64.9,43.97 106.34,43.97 107.93,42.38 编码器3.4
C26: length 65
  Bottom Layer w0.254: SW6.1 114.55,5.87 71.88,5.87 69.47,8.28 69.47,12.72 68.07,14.12 64.01,14.12 63.25,14.88 U6.56
C27: length 72.7
  Top Layer w0.254: v1(62.28,13.61) 62.22,13.68 62.22,21.25 61.21,22.25 U6.53 60.71,25.28 R48.2
  Bottom Layer w0.254: v1(62.28,13.61) 67.69,13.61 68.96,12.34 68.96,8.02 71.5,5.48 115.95,5.48 SW6.2
C28: length 37.8
  Top Layer w0.254: v1(56.9,20.85) 59.56,20.85 U6.54
  Bottom Layer w0.254: 41.4,39.14 39.47,37.21 39.47,29.13 40.77,27.84 46.99,27.84 49.02,25.8 49.02,24.28 49.78,23.52 55.81,23.52 56.9,22.43 v1(56.9,20.85)
C29: length 29.7
  Top Layer w0.254: v1(49.91,37.74) 44.47,37.74 44.43,37.78 42.58,37.78 41.4,36.6
  Bottom Layer w0.254: U6.51 53.59,26.82 53.59,37.11 52.96,37.74 v1(49.91,37.74)
C30: length 11.3
  Top Layer w0.254: U6.52 58.17,17.8 55.93,15.57 H69.3
C31: length 13.7
  Top Layer w0.254: U6.50 55.63,18.06 54.74,17.17 46.25,17.17 H69.1
CR: length 2.5
  Top Layer w0.254: R8.2 C14.2
CSI-3V3: length 10.1
  Top Layer w0.762: Q6.2 35.82,49.3 C66.1 41.28,49.17 41.4,49.3
D0: length 35
  Bottom Layer w0.254: U6.14 84.71,51.33 84.71,54.12 85.73,55.14 110.62,55.14 111.63,56.16 H62.6
D1: length 35
  Bottom Layer w0.254: U6.13 83.57,54.51 84.84,55.78 109.73,55.78 110.49,56.54 110.49,60.35 H62.5
D2: length 37.3
  Bottom Layer w0.254: U6.12 87.25,51.33 87.25,53.24 88.14,54.12 115.19,54.12 116.71,55.65 H62.2
D3: length 37.3
  Bottom Layer w0.254: H62.1 115.44,60.22 115.44,55.78 114.43,54.76 87.38,54.76 86.11,53.49 U6.11
D4: length 75.5
  Bottom Layer w0.254: U6.10 88.65,48.16 88.14,47.65 73.28,47.65 72.38,48.55 72.38,53.12 71.25,54.25 44.7,54.25 43.31,52.86 41.15,52.86 39.88,51.58 39.88,41.81 39.18,41.11 TOF1.5
D12: length 90.9
  Top Layer w0.254: v1(112.14,67) 112.14,66.32 110.46,64.64 102.46,64.64 101.98,64.16 v1(101.98,56.54) 101.96,56.51 101.96,12.64 TOF3.5
  Bottom Layer w0.254: P1.8 110.87,68.27 v1(112.14,67) ; v1(101.98,56.54) 83.19,56.54 81.03,54.38 U6.15
D13: length 101.7
  Top Layer w0.254: P1.7 110.87,65.56 110.31,65 82.5,65 82.17,64.67 82.17,51.33 U6.16 81.03,24.79 80,23.76 80,18.81 79.25,18.06 64.77,18.06 62.86,16.15 62.86,11.39 TOF2.5
D14: length 45
  Top Layer w0.254: v1(109.09,66.44) 108.36,65.71 80.92,65.71 80.67,65.45 80.67,55.67 78.49,53.49 U6.17
  Bottom Layer w0.254: P1.6 108.33,66.7 108.58,66.44 v1(109.09,66.44)
D15: length 50.8
  Top Layer w0.254: v1(110.11,66.44) 109.02,65.35 81.28,65.35 81.03,65.1 81.03,55.52 79.88,54.38 79.88,51.58 U6.18
  Bottom Layer w0.254: v1(110.11,66.44) 110.24,66.32 113.16,66.32 113.41,66.57 P1.10
D16: length 14.3
  Bottom Layer w0.254: 无线串口1.1 83.57,60.22 83.57,58.44 83.19,58.06 77.34,58.06 75.95,56.67 U6.19
D17: length 18.7
  Bottom Layer w0.254: U6.20 77.09,51.33 77.09,56.16 78.61,57.68 85.98,57.68 86.23,57.94 无线串口1.3
D26: length 60
  Top Layer w0.254: U6.84 100.58,21.49 100.58,63.65 99.82,64.41 87.76,64.41 无线串口1.4
D27: length 40
  Top Layer w0.254: SW6.3 114.68,4.21 114.68,6.75 113.28,8.15 v1(94.87,8.15) ; U6.81 94.82,20.8 v1(94.82,11.45)
  Bottom Layer w0.254: v1(94.82,11.45) 94.82,8.2 v1(94.87,8.15)
$1N5765: length 2.2
  Top Layer w0.508: R3.2 55.06,30.32 Q1.1
$1N5766: length 4.9
  Top Layer w0.508: BUZZER3.2 60.86,34.55 Q1.3
$1N5940: length 3.6
  Top Layer w0.508: BUZZER3.1 69.48,34.57 R2.2
$1N5970: length 2.7
  Top Layer w0.254: R35.2 41.39,41.69 41.4,41.68
$1N5984: length 2.4
  Top Layer w0.381: U1.4 24.13,45.7 R38.2
$1N5985: length 3.1
  Top Layer w0.762: C37.1 17.13,45.7 U1.1
$1N5986: length 6.5
  Top Layer w0.762: v2(12.45,48.79) 12.95,49.29 C37.2 17.38,51.14 U1.8
$1N5987: length 7.6
  Top Layer w0.381: R39.2 23.95,50.15 C36.2 ; U1.6 v1(20.49,52.73)
  Bottom Layer w0.381: v1(20.49,52.73) v1(23.88,52.73)
$1N5988: length 3
  Top Layer w0.381: R39.1 26.97,51.61 C35.2
$1N5989: length 6.2
  Top Layer w0.381: R37.2 24.01,55.02 R40.2 21.76,54.99 U1.5
$1N6012: length 6.3
  Top Layer w0.254: U6.9 89.15,52.73 90.04,51.84 90.04,47.35 R8.1
$1N6034: length 2.5
  Top Layer w0.508: LED8.1 14.86,37.9 R33.1
$1N6099: length 2.7
  Top Layer w0.381: 17.33,19.1 17.28,19.15 R59.2
$1N6100: length 3.1
  Top Layer w0.762: C88.1 21.69,19.1 21.14,19.1
$1N6101: length 5.4
  Top Layer w0.762: v2(25.78,15.14) 25.64,15.28 C88.2 21.89,13.66 U27.8
$1N6102: length 8.2
  Top Layer w0.381: C87.2 14.61,12.34 R60.2 ; U27.6 v1(18.6,12.22)
  Bottom Layer w0.381: v1(18.6,12.22) v1(14.48,12.22)
$1N6103: length 2.6
  Top Layer w0.381: C86.2 12.48,14.63 R60.1
$1N6104: length 6
  Top Layer w0.381: U27.5 17.33,9.65 ; 17.33,9.65 17.31,9.68 R58.2 ; 17.33,9.65 R61.2
$1N6110: length 2.3
  Top Layer w0.508: R56.1 14.93,25.69 LED9.1
$1N6112: length 2.4
  Top Layer w0.254: R62.1 98.51,59.99 LED12.2
$1N6115: length 2.2
  Top Layer w0.381: R63.1 25.11,58.39 LED13.2
$1N6120: length 2.7
  Top Layer w0.254: LED14.2 75.77,64.58 R64.1
$1N6124: length 2.4
  Top Layer w0.254: R65.1 61.83,64.38 59.55,64.38
$1N6125: length 2.9
  Top Layer w0.254: R66.1 77.26,16.15 77.39,16.03 77.77,16.03
$1N6127: length 2.3
  Top Layer w0.254: LED10.2 112.11,54.42 R67.1
$1N9649: length 2.5
  Top Layer w0.254: LED16.2 47.57,64.5 R68.1

## Copper pours and planes (outline as drawn; the poured copper is in the pictures)
GND on Top Layer: -22.1,88.92 148.08,88.92 148.08,-8.23 -22.1,-8.23
GND on Bottom Layer: -17.53,83.46 140.97,83.46 140.97,-4.42 -17.53,-4.42
GNDBAT on Top Layer: 14.1,60.81 13.59,60.81 13.75,45.11 27.86,44.91 27.86,42.69 25.91,42.69 25.91,20.09 11.18,20.09 11.05,20.22 11.05,10.89 11.89,10.89 11.89,7.74 14.5,7.74 14.5,3.81 26.27,3.81 28.7,6.25 47.65,6.25 47.65,-4.65 47.62,-4.68 -8,-4.68 -8.38,-5.06 -8.38,73.81 -8,74.19 14.1,74.19
GNDBAT on Top Layer: -6.22,72.03 14.1,72.03 14.1,60.6 13.72,60.6 13.72,48.92 17.13,45.5 17.13,45.06 27.99,45.06 28.07,44.99 28.07,42.57 25.65,42.57 25.65,19.96 11.12,19.96 11.12,10.94 12.06,10.94 12.06,7.9 12.06,7.9 14.48,7.9 14.48,3.96 27.22,3.96 29.79,6.54 47.85,6.54 47.88,6.51 47.88,-2.9 -5.59,-2.9 -6.22,-2.26
GNDBAT on Bottom Layer: -4.83,71.65 -4.95,71.78 13.97,71.78 13.97,60.22 13.72,60.22 13.72,52.98 13.46,52.73 17.91,52.73 18.03,52.86 18.03,44.73 18.16,44.6 25.78,44.6 25.78,20.22 11.43,20.22 11.43,10.82 11.87,7.83 15.49,4.21 27.12,3.71 28.87,5.45 28.87,6.25 47.65,6.25 47.73,6.32 47.73,-3.81 47.37,-4.17 -4.19,-4.17 -4.95,-3.41 -4.95,71.52
VCC5V on Top Layer: 18.16,65.48 24.77,65.48 24.77,53.49 18.16,53.49
VCC5V0 on Top Layer: 18.67,10.49 26.54,10.49 26.54,5.48 18.67,5.48
VCCBAT on Top Layer: 2.15,43.2 10.03,43.2 10.03,16.03 2.15,16.03
$1N5986 on Bottom Layer: 11.05,56.79 13.72,56.79 13.72,46.5 11.05,46.5
$1N6101 on Bottom Layer: 25.15,17.93 27.94,17.93 27.94,7.64 25.15,7.64
$1N16320 on Top Layer: 2.03,55.65 8.89,55.65 8.89,44.22 2.03,44.22

Small or netless copper shapes (teardrops, artwork), in the pictures only: 261 on Top Layer, 116 on Bottom Layer

## Text on the board
Top Layer: 湖北文理学院 智能视觉组 / 湖文凤雏八队 2025.5.16 | 陈仁凯 / 张惟羲 / 何于顺
Top Solder Mask Layer: 湖北文理学院 智能视觉组 / 湖文凤雏八队 2025.5.16 | 陈仁凯 / 张惟羲 / 何于顺
Top Silkscreen Layer: C26 | C27 | D27 | C31 GND C30 | B18TX,B19RX,G,5V | B12TX,B13RX,G,5V | 5V,G,C16TX,C17RX | 3V3 C24 / GND C2 | 3V3 C25 / GND C3 | 3V3 C1 / GND C0 | GND | D0 GND D2 | D1 GND D3 | 3V3 | C15 | C14 | C13 | C12 | 5V | VCCBAT | VCC6V0 | GNDBAT | ART | G | MCX | MV5 | ON | C4 | C5 | C6 | 灰度传感器 | 驱动接口 | 正 | 负 | 补光板 | 开 | 关
